# EAGLE design burn (EAGLE 8.4.1)
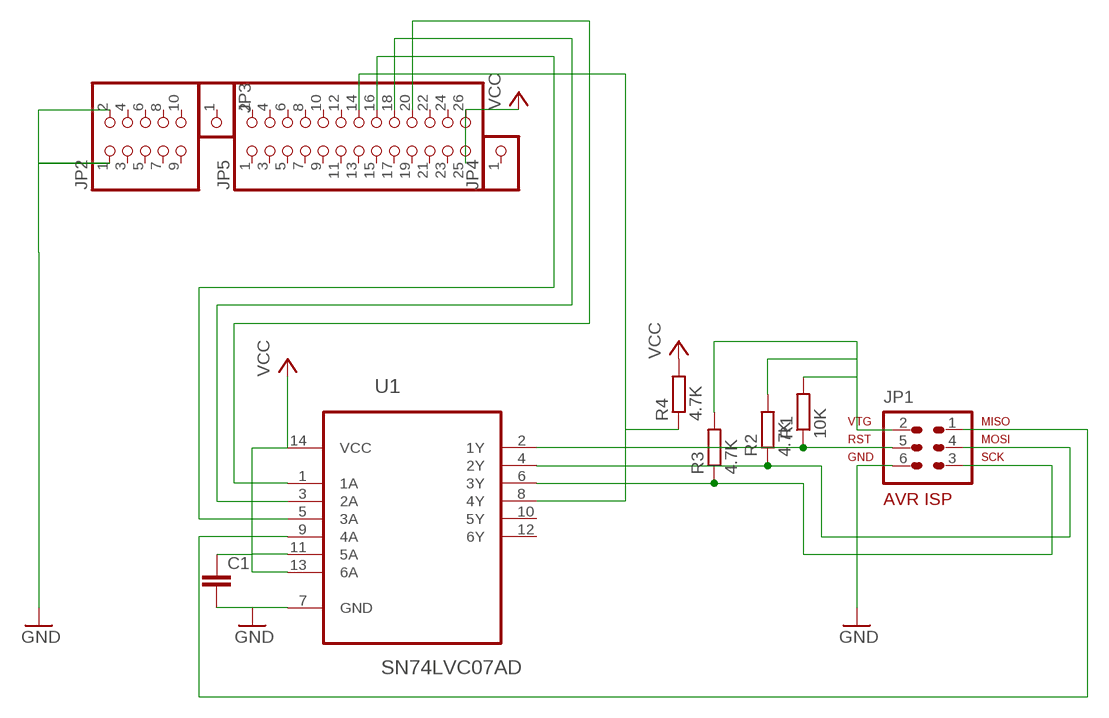
[diagram p0: schematic, sheet 1]

## Parts
C1  C-EUC1206K  [C1206K]
JP1  AVR-ISP  AVR-ISP-6  [AVR-ISP-6]
JP2  PINHD-2X5  [2X05]
JP3  PINHD-1X1  [1X01]
JP4  PINHD-1X1  [1X01]
JP5  PINHD-2X13  [2X13]
R1  10K  R-EU_R1206W  [R1206W]
R2  4.7K  R-EU_R1206W  [R1206W]
R3  4.7K  R-EU_R1206W  [R1206W]
R4  4.7K  R-EU_R1206W  [R1206W]
U1  SN74LVC07AD  [SOIC127P600X175-14N]

## Nets
GND: C1.2 JP1.6 JP2.1 JP2.2 U1.7(GND)
N$1: JP5.16 U1.5(3A)
N$2: JP1.5 R1.1 U1.2(1Y)
N$3: JP5.20 U1.1(1A)
N$4: JP5.18 U1.3(2A)
N$5: JP1.4 R2.1 U1.4(2Y)
N$6: JP1.3 R3.1 U1.6(3Y)
N$7: JP5.14 R4.1 U1.8(4Y)
N$8: JP1.1 U1.9(4A)
N$9: JP1.2 R1.2 R2.2 R3.2
VCC: C1.1 JP5.25 JP5.26 R4.2 U1.11(5A) U1.13(6A) U1.14(VCC)
Unconnected: JP2.3 JP2.4 JP2.5 JP2.6 JP2.7 JP2.8 JP2.9 JP2.10 JP3.1 JP4.1 JP5.1 JP5.2 JP5.3 JP5.4 JP5.5 JP5.6 JP5.7 JP5.8 JP5.9 JP5.10 JP5.11 JP5.12 JP5.13 JP5.15 JP5.17 JP5.19 JP5.21 JP5.22 JP5.23 JP5.24 U1.10(5Y) U1.12(6Y)

## Library data of the parts
C1 = resistor:C-EU: CAPACITOR, European symbol
JP1 = avr-6:AVR-ISP-6: AVR ISP-6 Serial Programming Header
JP2 = pinhead:PINHD-2X5: PIN HEADER
JP3 JP4 = pinhead:PINHD-1X1: PIN HEADER
JP5 = pinhead:PINHD-2X13: PIN HEADER
R1-R4 = resistor:R-EU_: RESISTOR, European symbol
U1 = SN74LVC07AD:SN74LVC07AD: HEX BUFFER/DRIVER WITH OPEN-DRAIN OUTPUTS; AVAILABILITY: Unavailable; DESCRIPTION: Buffer/Driver 6-CH Non-Inverting Open Drain CMOS 14-Pin SOIC Tube; MF: Texas Instruments; MP: SN74LVC07AD; PACKAGE: SOIC-14 Texas Instruments; PRICE: None

## Board
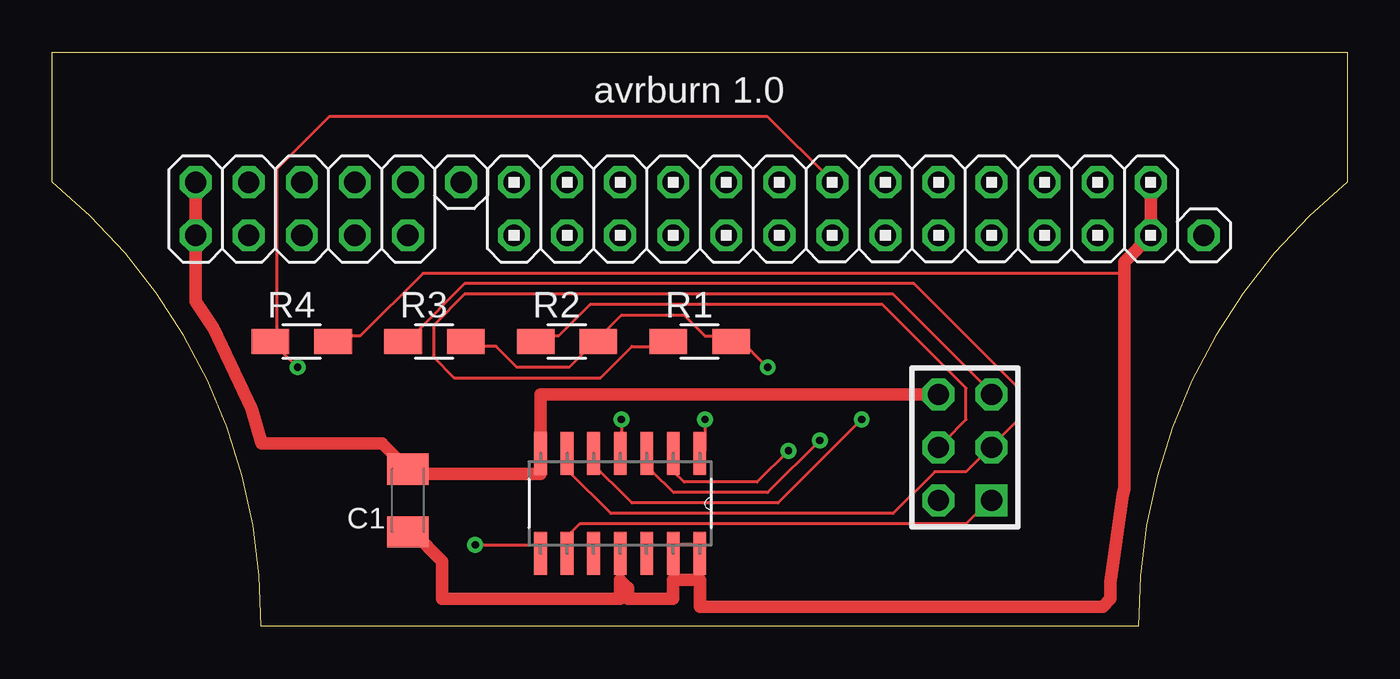
[diagram p1: board, top side]
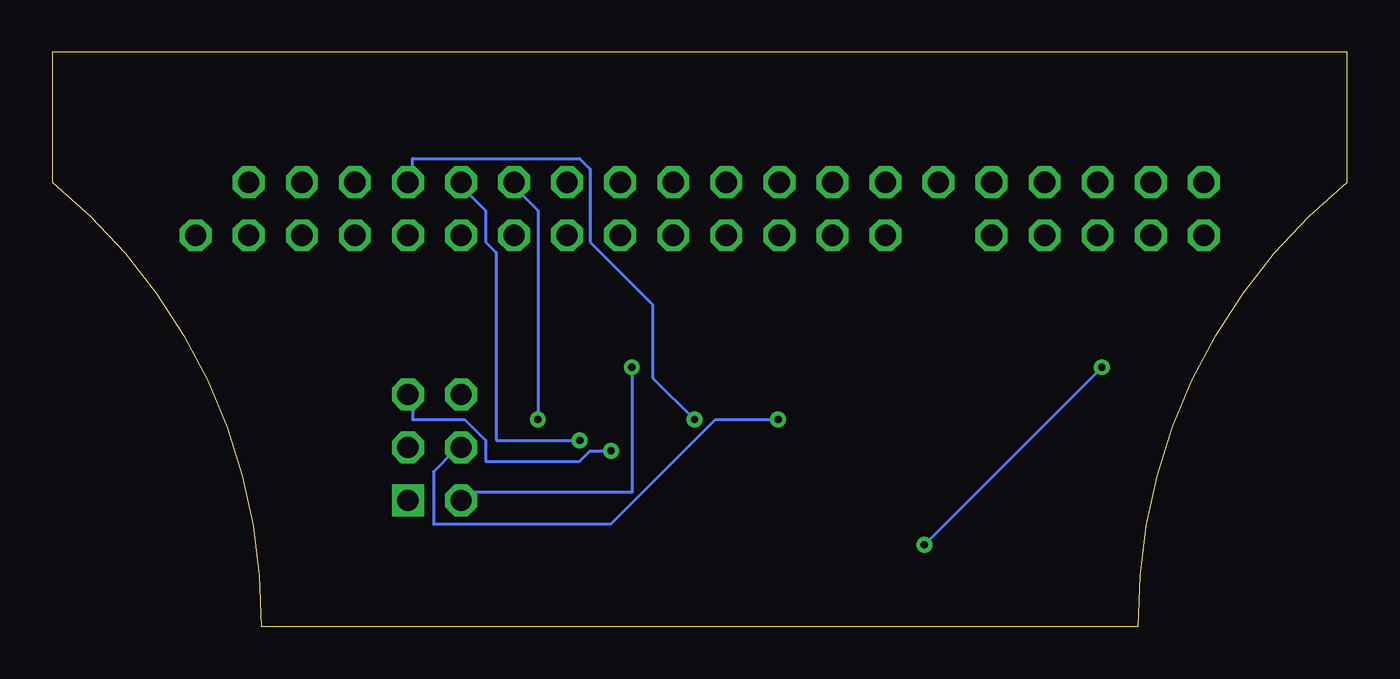
[diagram p2: board, bottom side, seen from below]

Size 62 x 27.5 mm. Coordinates in mm from the lower left corner, seen from the top.
Outline: 0,27.5 62,27.5 62,21.27 arc52 52,0 10,0 arc52 0,21.27 0,27.5
Copper layers (1*16): Top 0.035mm / dielectric 1.5mm / Bottom 0.035mm
Design rules "default": minimum track width 6mil, minimum drill 0.35mm, track to track 6mil, track to pad 6mil, pad to pad 6mil, via to via 6mil, smd to smd 6mil, copper to edge 40mil, drill to drill 6mil, minimum pad ring 10mil, minimum via ring 8mil, stop-mask expansion 4mil, vias tented up to drill 0mil, thermal gap 10mil

### Footprints (pad centres in the part's own frame; a part is rotated, then mirrored left to right if it is on the bottom)
C1206K = smd 1.5 x 2: 1 -1.5,0; 2 1.5,0
AVR-ISP-6 = drill 1.016 square: 1 -2.54,-1.27 | drill 1.016 octagon: 2 -2.54,1.27; 3 0,-1.27; 4 0,1.27; 5 2.54,-1.27; 6 2.54,1.27
2X05 = drill 1.016 octagon: 1 -5.08,-1.27; 2 -5.08,1.27; 3 -2.54,-1.27; 4 -2.54,1.27; 5 0,-1.27; 6 0,1.27; 7 2.54,-1.27; 8 2.54,1.27; 9 5.08,-1.27; 10 5.08,1.27
1X01 = drill 1.016 octagon: 1 0,0
2X13 = drill 1.016 octagon: 1 -15.24,-1.27; 2 -15.24,1.27; 3 -12.7,-1.27; 4 -12.7,1.27; 5 -10.16,-1.27; 6 -10.16,1.27; 7 -7.62,-1.27; 8 -7.62,1.27; 9 -5.08,-1.27; 10 -5.08,1.27; 11 -2.54,-1.27; 12 -2.54,1.27; 13 0,-1.27; 14 0,1.27; 15 2.54,-1.27; 16 2.54,1.27; 17 5.08,-1.27; 18 5.08,1.27; 19 7.62,-1.27; 20 7.62,1.27; 21 10.16,-1.27; 22 10.16,1.27; 23 12.7,-1.27; 24 12.7,1.27; 25 15.24,-1.27; 26 15.24,1.27
R1206W = smd 1.8 x 1.2: 1 -1.499,0; 2 1.499,0
SOIC127P600X175-14N = smd 2.057 x 0.61: 1 -4.801,7.62; 2 -4.801,6.35; 3 -4.801,5.08; 4 -4.801,3.81; 5 -4.801,2.54; 6 -4.801,1.27; 7 -4.801,0; 8 0,0; 9 0,1.27; 10 0,2.54; 11 0,3.81; 12 0,5.08; 13 0,6.35; 14 0,7.62

### Placement (x,y rotation side)
C1  17.03,6.03 90 top
JP1  43.7,8.57 90 top
JP2  11.95,20 0 top
JP3  55.13,18.73 0 top
JP4  19.57,21.27 0 top
JP5  37.35,20 0 top
R1  31,13.65 0 top
R2  24.65,13.65 0 top
R3  18.3,13.65 0 top
R4  11.95,13.65 0 top
U1  23.38,3.49 270 top

### Tracks (layer width: path | path; a pad name or v marks a point on that pad's centre or on a via)
GND
  Top 0.152: U1.7 23.25,8.41 23.38,8.41
  Top 0.61: JP2.2 JP2.1 6.87,15.55 7.72,14.27 9.54,10.42 10.03,8.76 15.8,8.76 C1.2 17.26,7.3 23.38,7.3 U1.7 23.38,8.41 23.38,11.11 JP1.6
N$1  (via drill 0.35)
  Top 0.152: v38.75,9.91 34.75,5.91 27.75,5.91 25.75,7.91 U1.5
  Bottom 0.152: v38.75,9.91 38.75,19.91 39.75,20.91 JP5.16
N$2  (via drill 0.35)
  Top 0.152: R1.1 29.25,13.41 27.75,13.41 26.25,11.91 19.25,11.91 18.25,12.91 18.25,14.41 19.75,15.91 40.25,15.91 44.75,11.41 JP1.5 | v35.25,8.41 33.75,6.91 30.25,6.91 29.75,7.41 29.75,7.91 U1.2
  Bottom 0.152: v35.25,8.41 36.25,8.41 36.75,7.91 41.25,7.91 41.25,8.91 42.25,9.91 44.75,9.91 44.75,10.91 JP1.5
N$3  (via drill 0.35)
  Top 0.152: v31.25,9.91 31.25,8.41 U1.1
  Bottom 0.152: v31.25,9.91 33.25,11.91 33.25,15.41 36.25,18.41 36.25,21.91 36.75,22.41 44.75,22.41 44.75,21.41 JP5.20
N$4  (via drill 0.35)
  Top 0.152: v36.75,8.91 34.25,6.41 29.75,6.41 28.75,7.41 28.75,7.91 U1.3
  Bottom 0.152: v36.75,8.91 40.75,8.91 40.75,17.91 41.25,18.41 41.25,19.91 42.25,20.91 JP5.18
N$5  (via drill 0.35)
  Top 0.152: R2.1 23.25,13.91 24.25,13.91 25.75,15.41 39.75,15.41 43.75,11.41 43.75,9.91 42.75,8.91 JP1.4 | v27.25,9.91 27.25,8.41 U1.4
  Bottom 0.152: v27.25,9.91 30.25,9.91 35.25,4.91 43.75,4.91 43.75,7.41 42.75,8.41 JP1.4
N$6
  Top 0.152: R3.1 17.25,13.91 19.75,16.41 41.25,16.41 46.25,11.41 46.25,9.91 45.25,8.91 JP1.3 44.75,8.41 43.75,7.41 42.25,7.41 40.25,5.41 26.75,5.41 24.75,7.41 24.75,7.91 U1.6
N$7  (via drill 0.35)
  Top 0.152: JP5.14 37.25,21.41 34.25,24.41 13.25,24.41 10.75,21.91 10.75,13.91 R4.1 10.75,13.41 v11.75,12.41 | v20.25,3.91 23.25,3.91 U1.8
  Bottom 0.152: v11.75,12.41 v20.25,3.91
N$8
  Top 0.152: U1.9 24.75,3.91 24.75,4.41 25.25,4.91 43.75,4.91 44.75,5.91 JP1.1
N$9  (via drill 0.35)
  Top 0.152: R3.2 20.25,13.41 21.25,13.41 22.25,12.41 24.75,12.41 25.75,13.41 R2.2 26.25,13.91 27.25,14.91 30.25,14.91 31.25,13.91 32.25,13.91 R1.2 32.75,13.91 v34.25,12.41
  Bottom 0.152: v34.25,12.41 34.25,6.41 42.25,6.41 JP1.2
VCC
  Top 0.152: U1.14 30.75,3.91 29.75,3.91 U1.13 29.75,3.41 29.75,2.41 29.73,2.22 | R4.2 13.75,13.91 14.75,13.91 17.75,16.91 51.25,16.91 51.32,16.91 | C1.1 17.25,4.41 17.32,4.48 | U1.11 27.25,3.41 27.25,2.41 27.19,2.22
  Top 0.61: JP5.26 JP5.25 51.32,17.46 51.32,16.91 51.32,6.58 51.25,6.33 50.66,2.12 50.66,1.32 50.29,0.95 31,0.95 31,2.22 29.73,2.22 29.73,1.32 27.56,1.32 27.56,1.85 27.19,2.22 27.19,1.32 18.67,1.32 18.67,3.12 17.32,4.48 17.03,4.76

### Text on the board
tPlace: avrburn 1.0